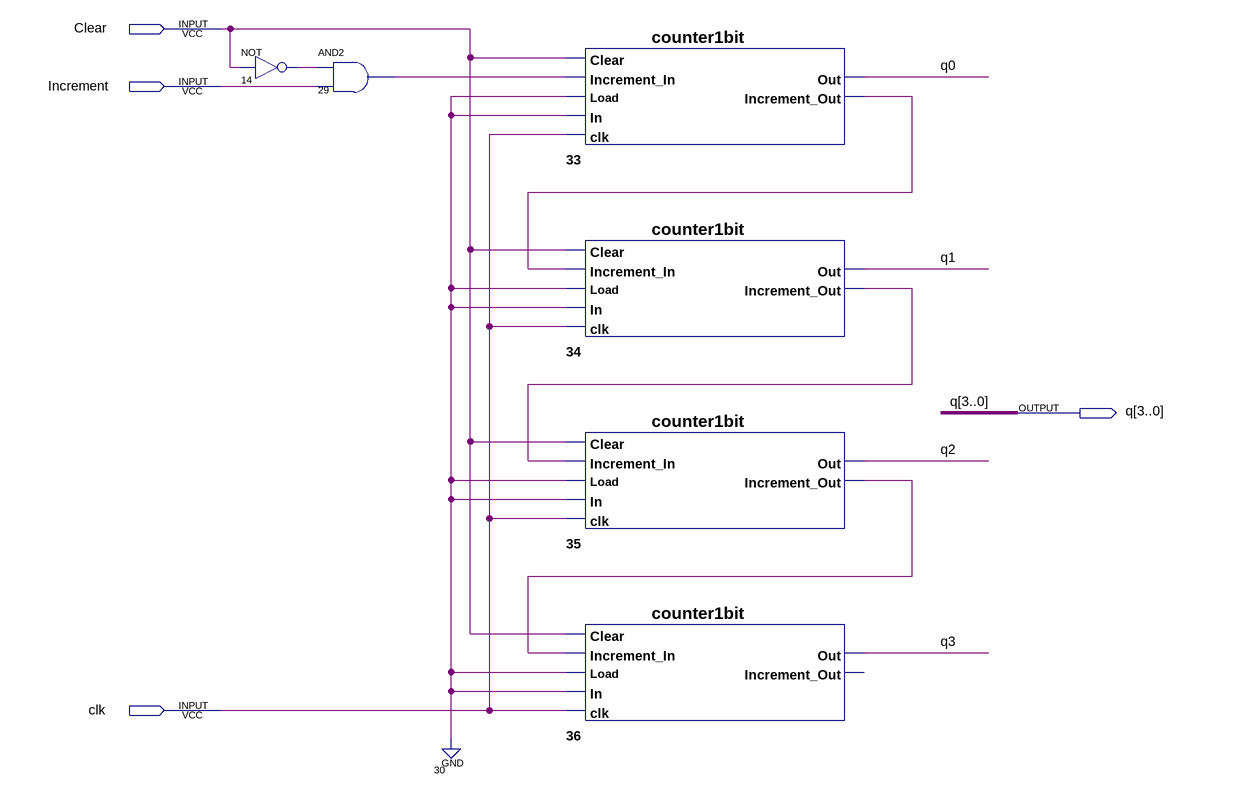
[diagram p0: schematic sheet]
// Quartus schematic counter4bits.bdf as structural Verilog: 6 symbols, 4 pins
module counter4bits (
  input  Clear,
  input  Increment,
  input  clk,
  output [3:0] q
);

  wire n14_out, n29_out, n33_increment_out, n34_increment_out, n35_increment_out;

  not u_14 (n14_out, Clear);
  and u_29 (n29_out, n14_out, Increment);
  counter1bit u_33 (
    .Clear(Clear), .Increment_In(n29_out), .Load(1'b0), .In(1'b0), .clk(clk), .Out(q[0]),
    .Increment_Out(n33_increment_out));
  counter1bit u_34 (
    .Clear(Clear), .Increment_In(n33_increment_out), .Load(1'b0), .In(1'b0), .clk(clk), .Out(q[1]),
    .Increment_Out(n34_increment_out));
  counter1bit u_35 (
    .Clear(Clear), .Increment_In(n34_increment_out), .Load(1'b0), .In(1'b0), .clk(clk), .Out(q[2]),
    .Increment_Out(n35_increment_out));
  counter1bit u_36 (
    .Clear(Clear), .Increment_In(n35_increment_out), .Load(1'b0), .In(1'b0), .clk(clk), .Out(q[3]));  // open: Increment_Out
endmodule
